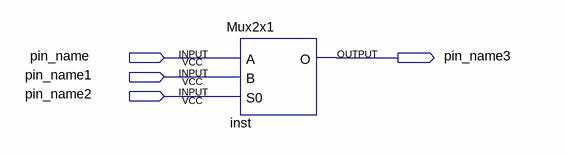
[diagram p0: schematic sheet]
// Quartus schematic TESTE.bdf as structural Verilog: 1 symbols, 4 pins
module TESTE (
  input  pin_name,
  input  pin_name1,
  input  pin_name2,
  output pin_name3
);

  Mux2x1 inst (.A(pin_name), .B(pin_name1), .S0(pin_name2), .O(pin_name3));
endmodule
